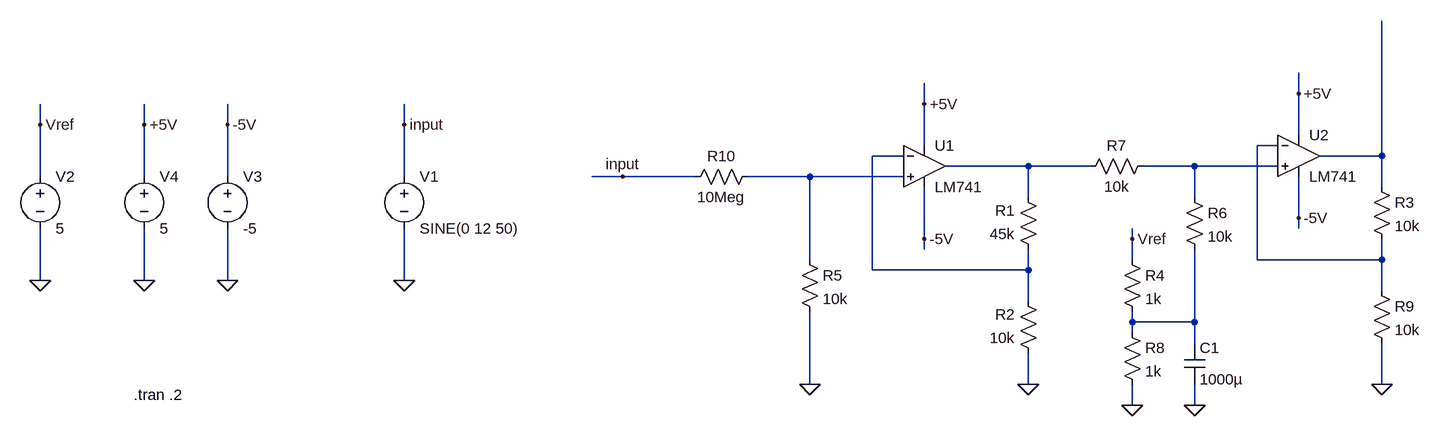
[diagram p0: schematic Kitojo Oscilloscope.asc]
Kitojo Oscilloscope.asc, the LTspice schematic file:
Version 4
SHEET 1 1284 680
WIRE 784 32 784 0
WIRE 208 48 208 16
WIRE -1152 80 -1152 48
WIRE -992 80 -992 48
WIRE -864 80 -864 48
WIRE -592 80 -592 48
WIRE 784 96 784 32
WIRE 208 112 208 48
WIRE 752 112 720 112
WIRE 176 128 128 128
WIRE 912 128 912 -80
WIRE 912 128 816 128
WIRE 368 144 240 144
WIRE 464 144 368 144
WIRE 624 144 544 144
WIRE 752 144 624 144
WIRE -1152 160 -1152 80
WIRE -992 160 -992 80
WIRE -864 160 -864 80
WIRE -592 160 -592 80
WIRE -256 160 -304 160
WIRE -144 160 -256 160
WIRE 32 160 -64 160
WIRE 176 160 32 160
WIRE 912 176 912 128
WIRE 368 192 368 144
WIRE 624 192 624 144
WIRE 784 224 784 160
WIRE 784 240 784 224
WIRE 208 256 208 176
WIRE 528 256 528 240
WIRE 208 272 208 256
WIRE 32 288 32 160
WIRE 528 288 528 256
WIRE 720 288 720 112
WIRE 912 288 912 256
WIRE 912 288 720 288
WIRE 128 304 128 128
WIRE 368 304 368 272
WIRE 368 304 128 304
WIRE -1152 320 -1152 240
WIRE -992 320 -992 240
WIRE -864 320 -864 240
WIRE -592 320 -592 240
WIRE 912 336 912 288
WIRE 368 352 368 304
WIRE 528 384 528 368
WIRE 624 384 624 272
WIRE 624 384 528 384
WIRE 528 400 528 384
WIRE 624 416 624 384
WIRE 32 480 32 368
WIRE 368 480 368 432
WIRE 912 480 912 416
WIRE 528 512 528 480
WIRE 624 512 624 480
FLAG -592 320 0
FLAG 368 480 0
FLAG 208 48 +5V
FLAG -592 80 input
FLAG -864 320 0
FLAG -864 80 -5V
FLAG 208 256 -5V
FLAG -992 320 0
FLAG -992 80 +5V
FLAG 784 32 +5V
FLAG 32 480 0
FLAG 784 224 -5V
FLAG -256 160 input
FLAG 912 480 0
FLAG -1152 320 0
FLAG -1152 80 Vref
FLAG 528 512 0
FLAG 624 512 0
FLAG 528 256 Vref
SYMBOL OpAmps\\LM741 208 80 R0
SYMATTR InstName U1
SYMBOL voltage -592 144 R0
WINDOW 123 0 0 Left 0
WINDOW 39 0 0 Left 0
SYMATTR InstName V1
SYMATTR Value SINE(0 12 50)
SYMBOL res 384 288 R180
WINDOW 0 36 76 Left 2
WINDOW 3 36 40 Left 2
SYMATTR InstName R1
SYMATTR Value 45k
SYMBOL res 384 448 R180
WINDOW 0 36 76 Left 2
WINDOW 3 36 40 Left 2
SYMATTR InstName R2
SYMATTR Value 10k
SYMBOL voltage -864 144 R0
WINDOW 123 0 0 Left 0
WINDOW 39 0 0 Left 0
SYMATTR InstName V3
SYMATTR Value -5
SYMBOL voltage -992 144 R0
WINDOW 123 0 0 Left 0
WINDOW 39 0 0 Left 0
SYMATTR InstName V4
SYMATTR Value 5
SYMBOL OpAmps\\LM741 784 64 R0
SYMATTR InstName U2
SYMBOL res 16 272 R0
SYMATTR InstName R5
SYMATTR Value 10k
SYMBOL res 608 176 R0
SYMATTR InstName R6
SYMATTR Value 10k
SYMBOL res 560 128 R90
WINDOW 0 0 56 VBottom 2
WINDOW 3 32 56 VTop 2
SYMATTR InstName R7
SYMATTR Value 10k
SYMBOL res -48 144 R90
WINDOW 0 0 56 VBottom 2
WINDOW 3 32 56 VTop 2
SYMATTR InstName R10
SYMATTR Value 10Meg
SYMBOL res 896 320 R0
SYMATTR InstName R9
SYMATTR Value 10k
SYMBOL voltage -1152 144 R0
WINDOW 123 0 0 Left 0
WINDOW 39 0 0 Left 0
SYMATTR InstName V2
SYMATTR Value 5
SYMBOL res 896 160 R0
SYMATTR InstName R3
SYMATTR Value 10k
SYMBOL res 512 272 R0
SYMATTR InstName R4
SYMATTR Value 1k
SYMBOL res 512 384 R0
SYMATTR InstName R8
SYMATTR Value 1k
SYMBOL cap 608 416 R0
SYMATTR InstName C1
SYMATTR Value 1000µ
TEXT -1008 496 Left 2 !.tran .2

The netlist it stands for:
* Kitojo Oscilloscope.asc
XU1 N006 N002 +5V -5V N004 LM741  ; pins In+ In- V+ V- OUT
V1 input 0 SINE(0 12 50)
R1 N002 N004 45k
R2 0 N002 10k
V3 -5V 0 -5
V4 +5V 0 5
XU2 N005 N001 +5V -5V N003 LM741  ; pins In+ In- V+ V- OUT
R5 N006 0 10k
R6 N005 N007 10k
R7 N005 N004 10k
R10 N006 input 10Meg
R9 N001 0 10k
V2 Vref 0 5
R3 N003 N001 10k
R4 Vref N007 1k
R8 N007 0 1k
C1 N007 0 1000µ
.tran .2
.lib LM741.lib
.backanno
.end